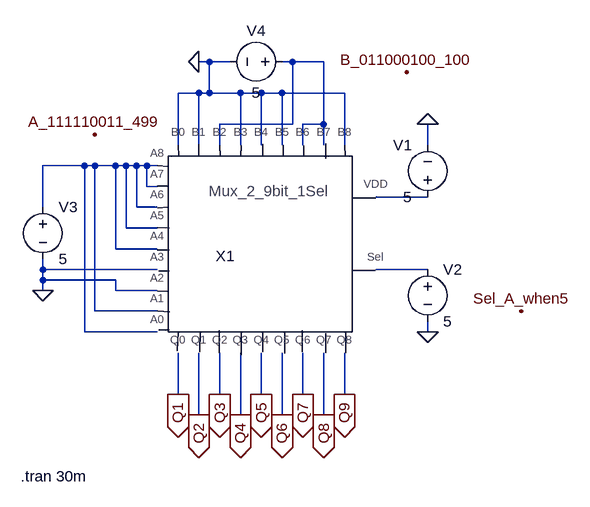
[diagram p0: schematic Simulating_MUX_2_9bit_1.asc]
Simulating_MUX_2_9bit_1.asc, the LTspice schematic file:
Version 4
SHEET 1 880 680
WIRE 112 -96 96 -96
WIRE 144 -96 112 -96
WIRE 240 -96 224 -96
WIRE 288 -96 240 -96
WIRE 96 -48 64 -48
WIRE 112 -48 112 -96
WIRE 112 -48 96 -48
WIRE 160 -48 112 -48
WIRE 192 -48 160 -48
WIRE 224 -48 192 -48
WIRE 320 -48 224 -48
WIRE 240 0 240 -96
WIRE 240 0 128 0
WIRE 288 0 288 -96
WIRE 288 0 256 0
WIRE 64 32 64 -48
WIRE 96 32 96 -48
WIRE 128 32 128 0
WIRE 160 32 160 -48
WIRE 192 32 192 -48
WIRE 224 32 224 -48
WIRE 256 32 256 0
WIRE 288 32 288 0
WIRE 320 32 320 -48
WIRE 448 32 448 0
WIRE -80 64 -144 64
WIRE -64 64 -80 64
WIRE -32 64 -64 64
WIRE -16 64 -32 64
WIRE 0 64 -16 64
WIRE 16 64 0 64
WIRE 32 64 16 64
WIRE 16 96 16 64
WIRE 32 96 16 96
WIRE 448 112 368 112
WIRE -144 128 -144 64
WIRE 0 128 0 64
WIRE 32 128 0 128
WIRE -16 160 -16 64
WIRE 32 160 -16 160
WIRE -32 192 -32 64
WIRE 32 192 -32 192
WIRE -144 224 -144 208
WIRE 32 224 -144 224
WIRE 448 224 368 224
WIRE -144 240 -144 224
WIRE -32 240 -144 240
WIRE -144 256 -144 240
WIRE -32 256 -32 240
WIRE 32 256 -32 256
WIRE -64 288 -64 64
WIRE 32 288 -64 288
WIRE -80 320 -80 64
WIRE 32 320 -80 320
WIRE 448 320 448 304
WIRE 64 416 64 352
WIRE 128 416 128 352
WIRE 192 416 192 352
WIRE 256 416 256 352
WIRE 320 416 320 352
WIRE 96 448 96 352
WIRE 160 448 160 352
WIRE 224 448 224 352
WIRE 288 448 288 352
FLAG 96 -96 0
FLAG -144 256 0
FLAG 448 320 0
FLAG 448 0 0
FLAG 64 416 Q1
IOPIN 64 416 Out
FLAG 96 448 Q2
IOPIN 96 448 Out
FLAG 128 416 Q3
IOPIN 128 416 Out
FLAG 160 448 Q4
IOPIN 160 448 Out
FLAG 192 416 Q5
IOPIN 192 416 Out
FLAG 224 448 Q6
IOPIN 224 448 Out
FLAG 256 416 Q7
IOPIN 256 416 Out
FLAG 288 448 Q8
IOPIN 288 448 Out
FLAG 320 416 Q9
IOPIN 320 416 Out
FLAG 592 288 Sel_A_when5
FLAG 416 -80 B_011000100_100
FLAG -64 16 A_111110011_499
SYMBOL MUX_2_9bit_1 224 128 R0
SYMATTR InstName X1
SYMBOL voltage 448 128 R180
WINDOW 0 24 96 Left 2
WINDOW 3 24 16 Left 2
WINDOW 123 0 0 Left 2
WINDOW 39 0 0 Left 2
SYMATTR InstName V1
SYMATTR Value 5
SYMBOL voltage 448 208 R0
WINDOW 123 0 0 Left 2
WINDOW 39 0 0 Left 2
SYMATTR InstName V2
SYMATTR Value 5
SYMBOL voltage -144 112 R0
WINDOW 123 0 0 Left 2
WINDOW 39 0 0 Left 2
SYMATTR InstName V3
SYMATTR Value 5
SYMBOL voltage 240 -96 R90
WINDOW 0 -32 56 VBottom 2
WINDOW 3 32 56 VTop 2
WINDOW 123 0 0 Left 2
WINDOW 39 0 0 Left 2
SYMATTR InstName V4
SYMATTR Value 5
TEXT -178 542 Left 2 !.tran 30m

The netlist it stands for:
* Simulating_MUX_2_9bit_1.asc
XX1 N002 0 0 N002 N002 N002 N002 N002 N002 0 N001 0 0 0 N001 N001 0 0 Q2 Q3 Q4 Q5 Q6 Q7 Q8 Q9 Q1 N003 N004 MUX_2_9bit_1  ; pins A1 A2 A3 A4 A5 A6 A7 A8 A0 B1 B2 B3 B4 B5 B6 B7 B8 B0 Q1 Q2 Q3 Q4 Q5 Q6 Q7 Q8 Q0 VDD Sel
V1 N003 0 5
V2 N004 0 5
V3 N002 0 5
V4 N001 0 5
.tran 30m
.backanno
.end